# EAGLE design Environment-ArduinoNano33-V10.1-MiddleBasic (EAGLE 7.4.0)
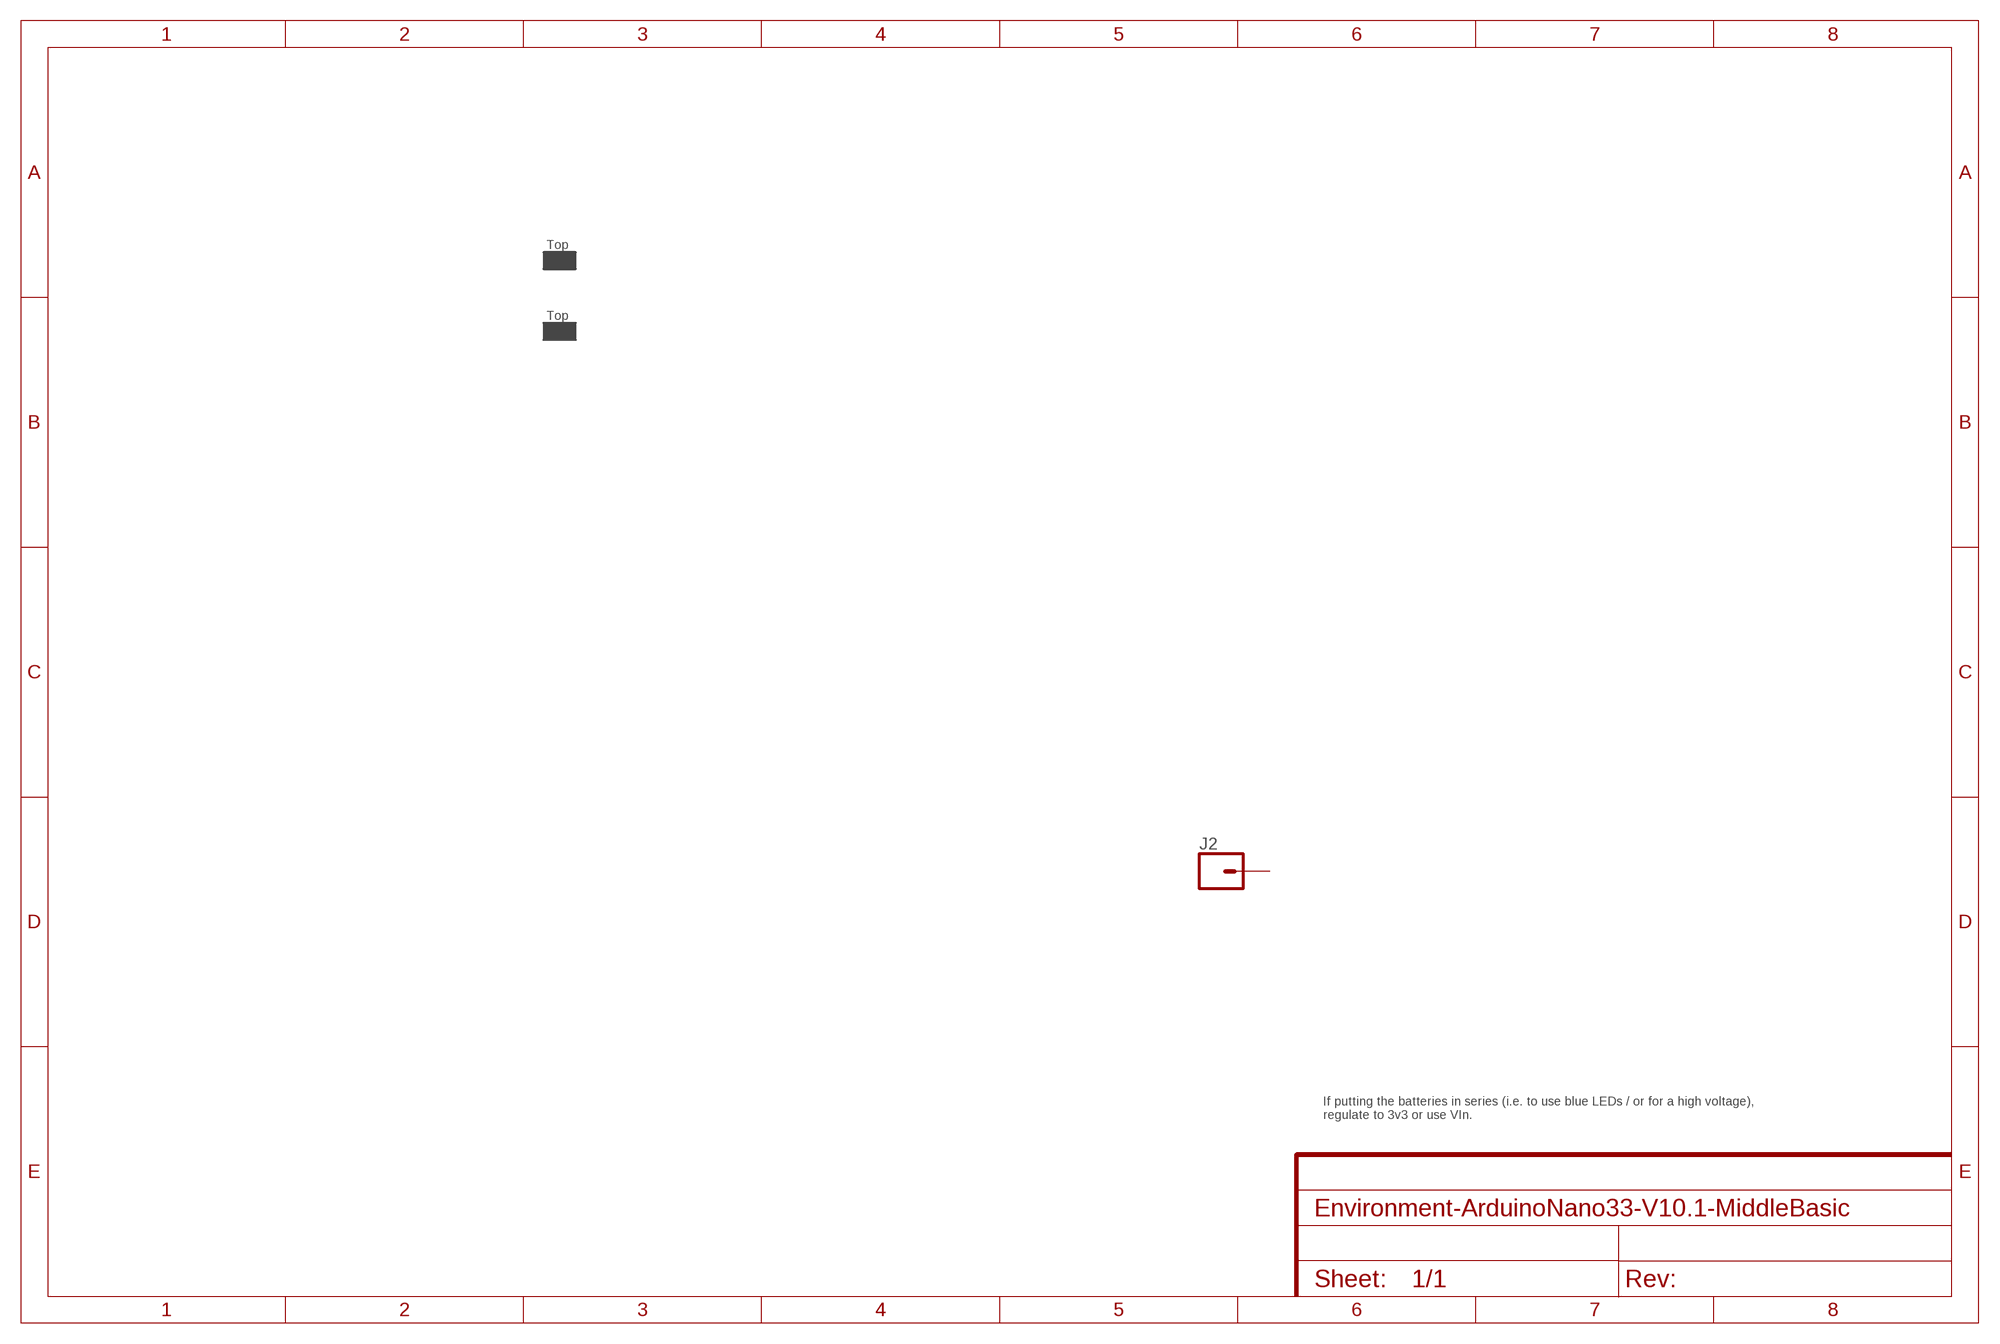
[diagram p0: schematic, sheet 1]

## Parts
J2  CONN_01  [1X01]
U$1  PERSONAL_ENVIRONMENT_SENSORBOTTOM  [PERSONAL_ENVIRONMENT_SENSOR_BOTTOM]
U$2  PERSONAL_ENVIRONMENT_SENSORTOP  [PERSONAL_ENVIRONMENT_SENSOR_TOP]
Unconnected: J2.1

## Notes on the sheet
- If putting the batteries in series (i.e. to use blue LEDs / or for a high voltage), 
  regulate to 3v3 or use VIn.

## Library data of the parts
J2 = SparkFun-Connectors:CONN_01: Single connection point. Often used as Generic Header-pin footprint for 0.1 inch spaced/style header connections On any of the 0.1 inch spaced packages, you can populate with these: Break Away Headers - Straight <https://www.sparkfun.com/products/116> (PRT-00116) Break Away Male Headers - Right Angle <https://www.sparkfun.com/products/553> (PRT-00553) Female Headers <https://www.sparkfun.com/products/115> (PRT-00115) Break Away Headers - Machine Pin <https://www.sparkfun.com/products/117> (PRT-00117) Break Away Female Headers - Swiss Machine Pin <https://www.sparkfun.com/products/743> (PRT-00743) This device is also useful as a general connection point to wire up your design to another part of your project. Our various solder wires solder well into these plated through hole pads. Hook-Up Wire - Assortment (Stranded, 22 AWG) <https://www.sparkfun.com/products/11375> (PRT-11375) Hook-Up Wire - Assortment (Solid Core, 22 AWG) <https://www.sparkfun.com/products/11367> (PRT-11367) View the entire wire category on our website here <https://www.sparkfun.com/categories/141> Special notes: SMTSO-256-ET is a "flush mount" nut for a 4-40 screw. We mostly use this on specialty testbeds; it is a nice way to connect hardware to your PCB at an adjustable hieght. Also note, the SNAP packages are for using a snappable style connector. We sell a baggie of snaps and they are also used on two LilyPad designs: Snap Assortment - 30 pack (male and female) <https://www.sparkfun.com/products/11347> (DEV-11347) LilyPad Arduino SimpleSnap <https://www.sparkfun.com/products/10941> (DEV-10941) LilyPad SimpleSnap Protoboard <https://www.sparkfun.com/products/10940> (DEV-10940)
U$1 U$2 = ThingySticks:PERSONAL_ENVIRONMENT_SENSOR

## Board
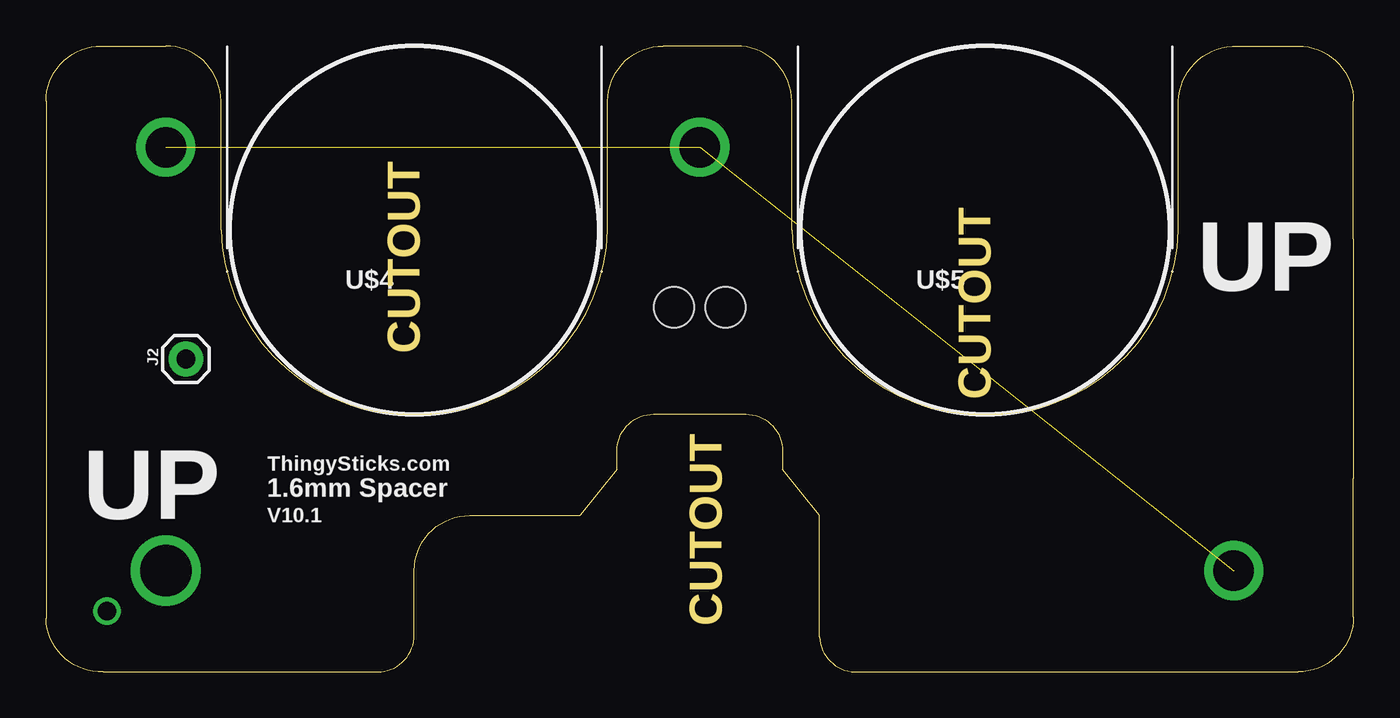
[diagram p1: board, top side]

Size 71 x 34 mm. Coordinates in mm from the lower left corner, seen from the top.
Outline: 0,31 0,2.9 arc90 3.1,0 18,0 arc90 20,2 20,5.5 arc-90 23,8.5 29,8.5 31,11 31,12 arc-90 33,14 38,14 arc-90 40,12 40,11 42,8.5 42,1.9 arc90 44.1,0 68,0 arc90 71,3 71,10.2 71,10.5 71,23.5 71,31 arc90 68,34 64.7,34 arc90 61.5,31 61.5,24 arc-90 51,14 arc-90 40.5,24 40.5,31 arc90 37.5,34 33.5,34 arc90 30.5,31 30.5,24 arc-90 20,14 arc-90 9.5,24 9.5,31 arc90 6.5,34 3,34 arc90 0,31
Copper layers (1*16): Top 0.035mm / dielectric 1.5mm / Bottom 0.035mm
Design rules "dirt_cheap_dirty_boards.v1.1": minimum track width 6mil, minimum drill 12mil, track to track 6mil, track to pad 6mil, pad to pad 6mil, via to via 6mil, smd to smd 0mil, copper to edge 10mil, drill to drill 10mil, minimum pad ring 10mil, minimum via ring 6mil, stop-mask expansion 2mil, vias tented up to drill 25mil, thermal gap 10mil
Holes 2.2 mm at 34.1,19.8 36.9,19.8
tKeepout: area 0,0 to 71,34; area 21.5,1.5 to 28.5,7.5
tRestrict: area 10,16 to 30,36; area 41,14 to 61,34; area 0,0 to 71,34

### Footprints (pad centres in the part's own frame; a part is rotated, then mirrored left to right if it is on the bottom)
1X01 = drill 1.016 pad 1.88: 1 0,0

### Placement (x,y rotation side)
J2  7.6,17 0 top
U$1  -2.8,41.5 0 top  (outside the outline)
U$2  -3,78.8 0 top  (outside the outline)
U$4  CR2032-SPLIT-PCB-MIDDLE  [CR2032-SMD-MIDDLE-OUTLINE]  20,24 0 top
U$5  CR2032-SPLIT-PCB-MIDDLE  [CR2032-SMD-MIDDLE-OUTLINE]  51,24 0 top

### Tracks (layer width: path | path; a pad name or v marks a point on that pad's centre or on a via)
3.3V1  (via drill 1)
  other vias: 3.3,3.3
GND  (via drill 2.2)  (2 unrouted)
  other vias: 6.5,28.5 64.5,5.5 35.5,28.5
N$1  (via drill 2.8)
  other vias: 6.5,5.5

### Text on the board
Dimension: CUTOUT | CUTOUT | CUTOUT
tNames: UP | ThingySticks.com | 1.6mm Spacer | UP | V10.1
Document: Keychain Middle. / Bottom wall slightly smaller to allow for a cover to slide on using the grove | For Enclosure: / Hammon - 1551V2WH - / Plastic Enclosure, Small, ABS, 80 mm, 40 mm, 20 mm, IP30 / / Farnell: 2985869 | Cable exit / From under PCB to / Front, then up to top | Changes: / / Moved bottom outline down to match the top/bottom boards for easier assembly
Reference: 1.6mm PCB | Middle PCB
tDocu: NFC Pads